# EAGLE design FoamBot Arduino Pololu servo r2 (EAGLE 7.1.0)
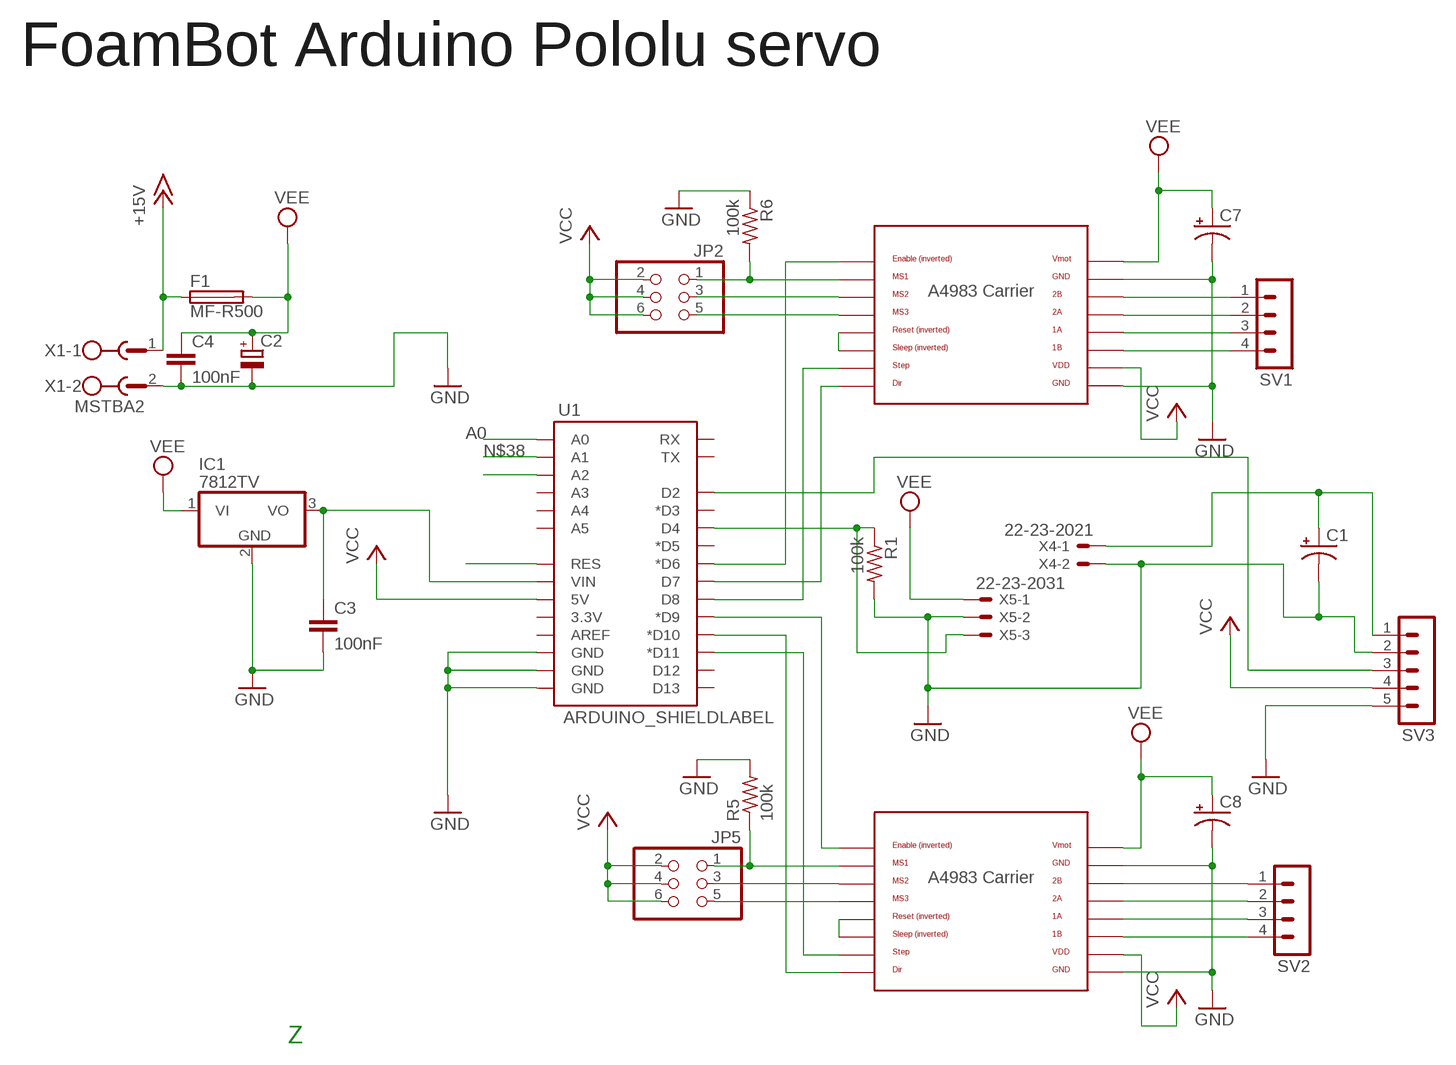
[diagram p0: schematic, sheet 1]

## Parts
C1  CPOL-USE5-10.5  [E5-10,5]
C2  CPOL-EUE7.5-16  [E7,5-16]
C3  100nF  C2,5-3  [C2.5-3]
C4  100nF  C2,5-3  [C2.5-3]
C7  CAP_POLPTH2  [CPOL-RADIAL-10UF-25V]
C8  CAP_POLPTH2  [CPOL-RADIAL-10UF-25V]
F1  MF-R500  LITTLEFUSE  [LITTLEFUSE]
IC1  7812TV  [TO220V]
JP2  PINHD-2X3  [2X03]
JP5  PINHD-2X3  [2X03]
R1  100k  R-US_0207/7  [0207/7]
R5  100k  R-US_0207/7  [0207/7]
R6  100k  R-US_0207/7  [0207/7]
SV1  MA04-1  [MA04-1]
SV2  MA04-1  [MA04-1]
SV3  MA05-1  [MA05-1]
U1  ARDUINO_SHIELDLABEL  [DUEMILANOVE_SHIELD]
U2  POLOLU_A4983CARRIER  [A4983CARRIER]
U3  POLOLU_A4983CARRIER  [A4983CARRIER]
X1  MSTBA2  [MSTBA2]
X4  22-23-2021  [22-23-2021]
X5  22-23-2031  [22-23-2031]

## Nets
+15V: F1.1 X1.1
A0: U1.A0
GND: C1.- C2.- C3.2 C4.2 C7.2(-) C8.2(-) IC1.2(GND) R1.2 R5.2 R6.1 SV3.2 SV3.5 U1.GND@0(GND) U1.GND@1(GND) U1.GND@2(GND) U2.GND U2.GND@0(GND) U3.GND U3.GND@0(GND) X1.2 X4.2 X5.2
N$1: U1.D8 U2.STEP
N$2: U1.D7 U2.DIR
N$3: SV1.1 U2.2B
N$4: SV1.2 U2.2A
N$5: JP5.1 R5.1 U3.MS1
N$6: JP5.3 U3.MS2
N$8: U2.RST U2.SLP(SLEEP)
N$9: C3.1 IC1.3(VO) U1.VIN
N$10: SV1.3 U2.1A
N$11: SV1.4 U2.1B
N$12: SV2.4 U3.1B
N$13: U1.D6(*D6) U2.EN
N$14: JP5.5 U3.MS3
N$15: JP2.1 R6.2 U2.MS1
N$16: U1.D11(*D11) U3.STEP
N$17: U1.D10(*D10) U3.DIR
N$18: JP2.3 U2.MS2
N$19: JP2.5 U2.MS3
N$20: U3.RST U3.SLP(SLEEP)
N$21: SV2.1 U3.2B
N$22: SV2.2 U3.2A
N$23: U1.D9(*D9) U3.EN
N$24: R1.1 U1.D4 X5.3
N$25: SV3.3 U1.D2
N$26: SV2.3 U3.1A
N$28: C1.+ SV3.1 X4.1
N$38: U1.A1
N$39: U1.A2
RESET: U1.RES
VCC: JP2.2 JP2.4 JP2.6 JP5.2 JP5.4 JP5.6 SV3.4 U1.5V U2.VDD U3.VDD
VEE: C2.+ C4.1 C7.1(+) C8.1(+) F1.2 IC1.1(VI) U2.VMOT U3.VMOT X5.1
Unconnected: U1.3.3V U1.A3 U1.A4 U1.A5 U1.AREF U1.D3(*D3) U1.D5(*D5) U1.D12 U1.D13 U1.RX U1.TX

## Notes on the sheet
- FoamBot Arduino Pololu servo
- Z

## Library data of the parts
C1 = resistor:CPOL-US: POLARIZED CAPACITOR, American symbol
C2 = rcl:CPOL-EU: POLARIZED CAPACITOR, European symbol
C3 C4 = capacitor-wima:C: CAPACITOR naming: grid - package width
C7 C8 = SparkFun-Capacitors:CAP_POL: Capacitor Polarized These are standard SMD and PTH capacitors. Normally 10uF, 47uF, and 100uF in electrolytic and tantalum varieties. Always verify the external diameter of the through hole cap, it varies with capacity, voltage, and manufacturer. The EIA devices should be standard.
F1 = fuse:LITTLEFUSE: LITTLEFUSE Picofuse/slow Littlefuse; OC_FARNELL: unknown; OC_NEWARK: unknown
IC1 = linear:78*: Positive VOLTAGE REGULATOR Source: http://cache.national.com/ds/LM/LM78L05.pdf http://www.fairchildsemi.com/ds/LM/LM7805.pdf
JP2 JP5 = pinhead:PINHD-2X3: PIN HEADER
R1 R5 R6 = adafruit:R-US_: RESISTOR, American symbol
SV1 SV2 = con-lstb:MA04-1: PIN HEADER; OC_FARNELL: unknown; OC_NEWARK: unknown
SV3 = con-lstb:MA05-1: PIN HEADER; OC_FARNELL: unknown; OC_NEWARK: unknown
U1 = SparkFun-Boards:ARDUINO_SHIELD: Arduino shield footprint
U2 U3 = ultimachine:POLOLU_A4983CARRIER
X1 = con-phoenix-508:MSTBA2: PHOENIX; MF: FARNELL; MPN: 1757242; OC_FARNELL: 3705171; OC_NEWARK: 71C4161
X4 = con-molex:22-23-2021: .100" (2.54mm) Center Header - 2 Pin; MF: MOLEX; MPN: 22-23-2021; OC_FARNELL: 1462926; OC_NEWARK: 25C3832
X5 = con-molex:22-23-2031: .100" (2.54mm) Center Header - 3 Pin; MF: MOLEX; MPN: 22-23-2031; OC_FARNELL: 1462950; OC_NEWARK: 30C0862

## Board
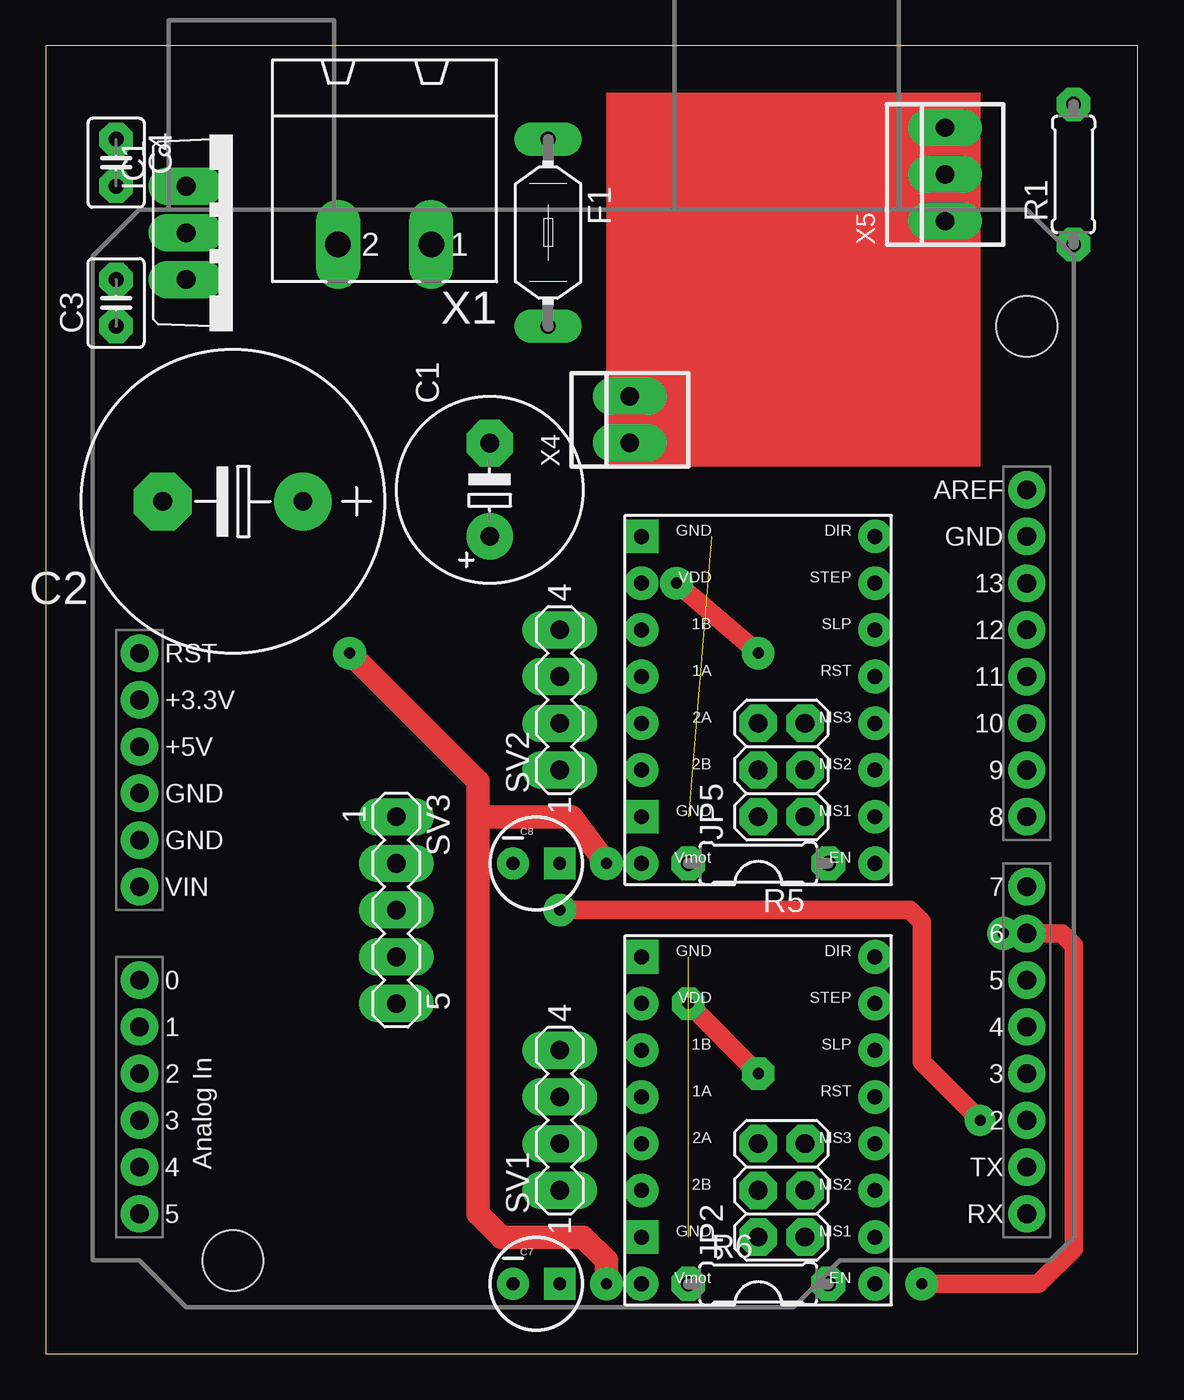
[diagram p1: board, top side]
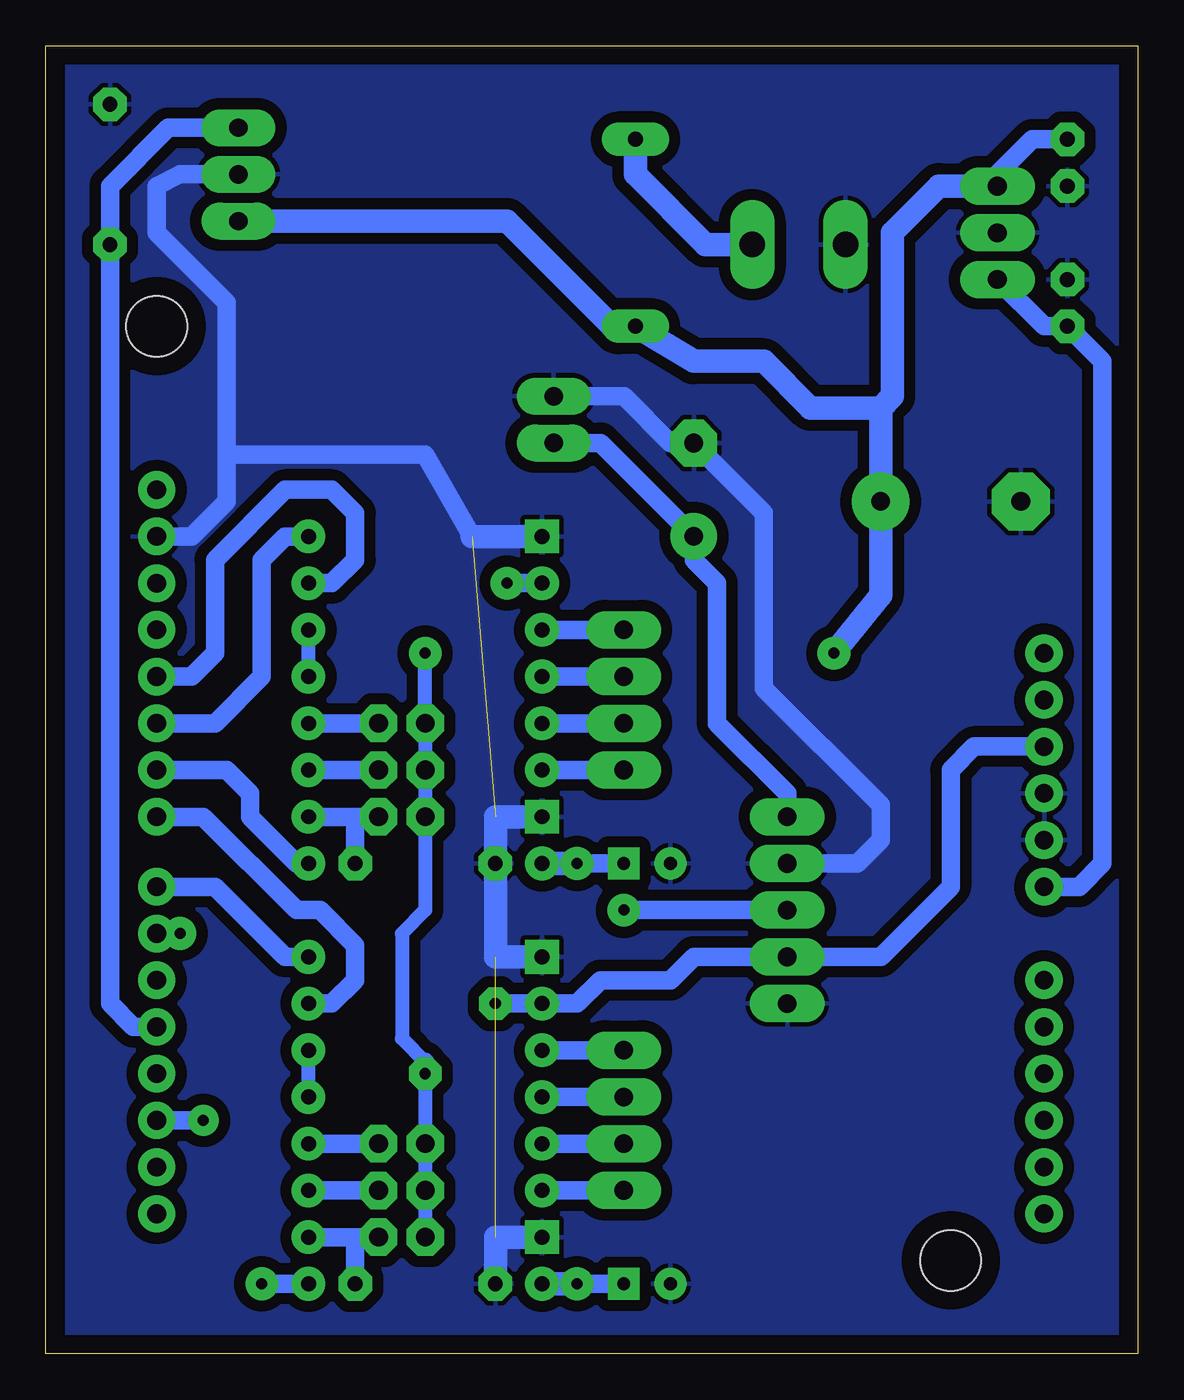
[diagram p2: board, bottom side, seen from below]

Size 59.36 x 71.1 mm. Coordinates in mm from the lower left corner, seen from the top.
Outline: 0,71.1 0,0 59.36,0 59.36,71.1 0,71.1
Copper layers (1*16): Top 0.035mm / dielectric 1.5mm / Bottom 0.035mm
Design rules "default *": minimum track width 30mil, minimum drill 30mil, track to track 8mil, track to pad 8mil, pad to pad 8mil, via to via 8mil, smd to smd 8mil, copper to edge 40mil, drill to drill 8mil, minimum pad ring 20mil, minimum via ring 10mil, stop-mask expansion 4mil, vias tented up to drill 0mil, thermal gap 10mil

### Footprints (pad centres in the part's own frame; a part is rotated, then mirrored left to right if it is on the bottom)
E5-10,5 = drill 1.016 pad 2.54: + -2.54,0 | drill 1.016 pad 2.54 octagon: - 2.54,0
E7,5-16 = drill 1.016 pad 3.15: + -3.81,0 | drill 1.016 pad 3.15 octagon: - 3.81,0
C2.5-3 = drill 0.813 pad 1.6 octagon: 1 -1.27,0; 2 1.27,0
CPOL-RADIAL-10UF-25V = drill 0.7 pad 1.651 square: 1 1.27,0 | drill 0.7 pad 1.651: 2 -1.27,0
LITTLEFUSE = drill 0.813 pad 1.778 long: 1 -5.08,0; 2 5.08,0
TO220V = drill 1.016 long: 1 -2.54,-2.54; 2 0,-2.54; 3 2.54,-2.54
2X03 = drill 1.016 octagon: 1 -2.54,-1.27; 2 -2.54,1.27; 3 0,-1.27; 4 0,1.27; 5 2.54,-1.27; 6 2.54,1.27
0207/7 = drill 0.813 octagon: 1 -3.81,0; 2 3.81,0
MA04-1 = drill 1.016 long: 1 -3.81,0; 2 -1.27,0; 3 1.27,0; 4 3.81,0
MA05-1 = drill 1.016 long: 1 -5.08,0; 2 -2.54,0; 3 0,0; 4 2.54,0; 5 5.08,0
DUEMILANOVE_SHIELD = drill 1.016 pad 1.88: 3.3V 50.8,26.67; 5V 50.8,29.21; A0 50.8,41.91; A1 50.8,44.45; A2 50.8,46.99; A3 50.8,49.53; A4 50.8,52.07; A5 50.8,54.61; AREF 2.54,15.24; D2 2.54,49.53; D3 2.54,46.99; D4 2.54,44.45; D5 2.54,41.91; D6 2.54,39.37; D7 2.54,36.83; D8 2.54,33.02; D9 2.54,30.48; D10 2.54,27.94; D11 2.54,25.4; D12 2.54,22.86; D13 2.54,20.32; GND@0 50.8,31.75; GND@1 50.8,34.29; GND@2 2.54,17.78; RES 50.8,24.13; RX 2.54,54.61; TX 2.54,52.07; VIN 50.8,36.83 | hole 3.302: 45.72,57.15; 2.54,6.35
A4983CARRIER = drill 0.813: 1A 8.89,1.27; 1B 11.43,1.27; 2A 6.35,1.27; 2B 3.81,1.27; DIR 16.51,-11.43; EN -1.27,-11.43; MS1 1.27,-11.43; MS2 3.81,-11.43; MS3 6.35,-11.43; RST 8.89,-11.43; SLP 11.43,-11.43; STEP 13.97,-11.43; VDD 13.97,1.27; VMOT -1.27,1.27 | drill 0.813 square: GND 16.51,1.27; GND@0 1.27,1.27
MSTBA2 = drill 1.397 long: 1 -2.54,5.08; 2 2.54,5.08
22-23-2021 = drill 1 long: 1 -1.27,0; 2 1.27,0
22-23-2031 = drill 1 long: 1 -2.54,0; 2 0,0; 3 2.54,0

### Placement (x,y rotation side)
C1  24.13,46.97 90 top
C2  10.16,46.34 180 top
C3  3.81,57.13 90 top
C4  3.81,64.75 270 top
C7  26.67,3.79 0 top
C8  26.67,26.65 0 top
F1  27.3,60.94 270 top
IC1  10.16,60.94 270 top
JP2  40.01,8.87 90 top
JP5  40.01,31.73 90 top
R1  55.88,64.11 90 top
R5  38.73,26.65 180 top
R6  38.73,3.79 0 top
SV1  27.94,12.68 90 top
SV2  27.94,35.54 90 top
SV3  19.05,24.11 270 top
U1  55.88,62.21 180 top
U2  33.66,5.06 90 top
U3  33.66,27.92 90 top
X1  18.41,65.39 180 top
X4  31.75,50.78 90 top
X5  48.9,64.11 90 top

### Tracks (layer width: path | path; a pad name or v marks a point on that pad's centre or on a via)
+15V
  Bottom 1.27: X1.1 23.49,60.3 27.3,64.11 F1.1
GND  (2 unrouted)
  Bottom 1.016: X5.2 52.07,64.11 53.34,63.48 53.34,60.94 49.53,57.13 49.53,48.88 | 49.53,48.88 38.73,48.88 36.2,44.43 | X4.2 27.94,52.05 25.4,49.51 C1.- 20.32,45.7 20.32,36.17 13.97,29.82 13.97,27.92 15.24,26.65 SV3.2 | U1.GND@2 51.44,44.43 49.53,46.34 49.53,48.88
  Bottom 1.27: U2.GND@0 34.93,6.33 R6.1 | U2.GND 34.93,21.57 R5.2 34.93,29.19 U3.GND@0 | 36.2,44.43 U3.GND
  pour Bottom (isolate 0.61): 0,71.1 0,-0.02 58.42,-0.02 58.42,71.1
N$1
  Bottom 1.016: U2.STEP 43.82,19.03 42.55,20.3 42.55,22.2 44.45,24.11 45.72,24.11 50.8,29.19 U1.D8
N$2
  Bottom 1.016: U2.DIR 46.36,21.57 50.16,25.38 U1.D7
N$3
  Bottom 1.016: U2.2B SV1.1
N$4
  Bottom 1.016: U2.2A SV1.2
N$5
  Bottom 1.016: U3.MS1 42.55,29.19 | 42.55,29.19 JP5.1 | R5.1 42.55,29.19
N$6
  Bottom 1.016: U3.MS2 JP5.3
N$8
  Bottom 0.762: U2.RST U2.SLP
N$9
  Bottom 1.016: IC1.3 5.08,55.86 C3.1 1.91,53.95 1.91,26.65 3.17,25.38 U1.VIN
N$10
  Bottom 1.016: U2.1A SV1.3
N$11
  Bottom 1.016: U2.1B SV1.4
N$12
  Bottom 1.016: U3.1B SV2.4
N$13  (via drill 0.6 pad 1.78)
  Top 1.016: v47.62,3.79 53.98,3.79 55.88,5.69 55.88,22.2 55.25,22.84 v52.07,22.84
  Bottom 1.016: U2.EN v47.62,3.79 | v52.07,22.84 U1.D6
N$14
  Bottom 1.016: U3.MS3 JP5.5
N$15
  Bottom 1.016: U2.MS1 42.55,6.33 | 42.55,6.33 JP2.1 | R6.2 42.55,6.33
N$16
  Bottom 1.016: U3.STEP 43.82,41.89 42.55,43.16 42.55,45.7 43.82,46.97 46.36,46.97 50.16,43.16 50.16,38.08 51.44,36.81 U1.D11
N$17
  Bottom 1.016: U3.DIR 46.36,44.43 47.62,43.16 47.62,36.81 50.16,34.27 U1.D10
N$18
  Bottom 1.016: U2.MS2 JP2.3
N$19
  Bottom 1.016: U2.MS3 JP2.5
N$20
  Bottom 0.762: U3.RST U3.SLP
N$21
  Bottom 1.016: U3.2B SV2.1
N$22
  Bottom 1.016: U3.2A SV2.2
N$23
  Bottom 1.016: U3.EN 45.72,26.65 48.26,29.19 48.26,30.46 49.53,31.73 U1.D9
N$24
  Bottom 1.016: X5.3 52.71,66.66 55.88,63.48 R1.1 55.88,19.03 54.61,17.76 U1.D4
N$25  (via drill 0.6 pad 1.68, 0.6 pad 1.78)
  Top 1.016: v50.8,12.68 47.62,15.86 47.62,23.47 46.99,24.11 v27.94,24.11
  Bottom 1.016: U1.D2 v50.8,12.68 | v27.94,24.11 SV3.3
N$26
  Bottom 1.016: U3.1A SV2.3
N$28
  Bottom 1.016: X4.1 29.21,49.51 C1.+ 24.13,43.16 22.86,41.89 22.86,34.27 19.05,30.46 SV3.1
VCC  (via drill 0.6 pad 1.78)
  Top 1.016: v34.29,41.89 v38.73,38.08 | v34.93,19.03 v38.73,15.22
  Bottom 0.762: JP2.2 JP2.4 JP2.6 38.73,15.86 40.01,17.12 40.01,22.84 38.73,24.11 JP5.2 JP5.4 JP5.6 v38.73,38.08
  Bottom 1.016: U1.5V 8.89,33 10.16,31.73 10.16,25.38 13.97,21.57 SV3.4 24.13,21.57 25.4,20.3 29.21,20.3 30.48,19.03 U2.VDD v34.93,19.03 | U3.VDD v34.29,41.89 | v38.73,15.22 38.73,15.86
VEE  (via drill 0.6 pad 1.78)
  Top 1.27: v16.51,38.08 23.49,31.09 23.49,29.19 | 23.49,29.19 23.49,7.6 24.76,6.33 29.21,6.33 30.48,5.06 v30.48,3.79 | 23.49,29.19 28.57,29.19 v30.48,26.65
  Bottom 1.016: IC1.1 7.62,64.11 5.71,66.02 C4.1 | C8.1 v30.48,26.65 | v30.48,3.79 C7.1
  Bottom 1.27: v16.51,38.08 13.97,41.25 C2.+ 13.97,51.41 | v30.48,3.79 U2.VMOT | v30.48,26.65 U3.VMOT | 13.97,51.41 13.34,52.05 13.34,60.94 10.79,63.48 IC1.1 | 13.97,51.41 17.78,51.41 20.32,53.95 24.13,53.95 F1.2 28.57,55.86 34.29,61.57 X5.1
(copper drawn outside any net)
  shapes: Top area x1